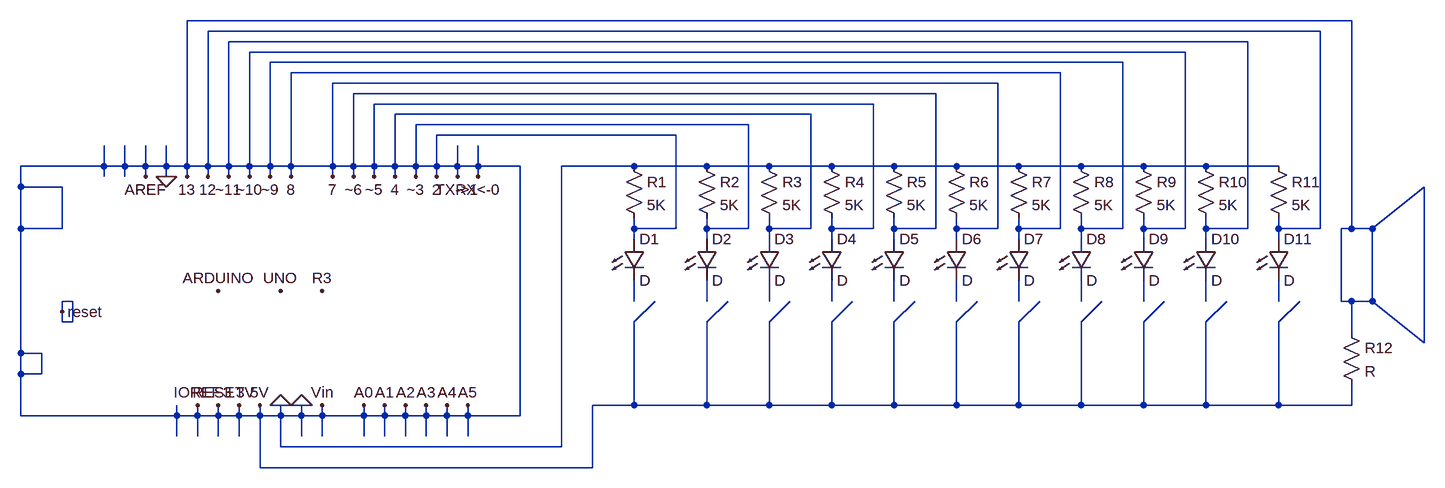
[diagram p0: schematic ARDUINO.asc]
ARDUINO.asc, the LTspice schematic file:
Version 4
SHEET 1 1412 824
WIRE 1184 64 -608 64
WIRE 1136 80 -576 80
WIRE 1024 96 -544 96
WIRE 928 112 -512 112
WIRE 832 128 -480 128
WIRE 736 144 -448 144
WIRE 640 160 -384 160
WIRE 544 176 -352 176
WIRE 448 192 -320 192
WIRE 352 208 -288 208
WIRE 256 224 -256 224
WIRE 144 240 -224 240
WIRE -736 288 -736 256
WIRE -736 288 -864 288
WIRE -704 288 -704 256
WIRE -704 288 -736 288
WIRE -672 288 -672 256
WIRE -672 288 -704 288
WIRE -640 288 -640 256
WIRE -640 288 -672 288
WIRE -608 288 -608 64
WIRE -608 288 -640 288
WIRE -576 288 -576 80
WIRE -576 288 -608 288
WIRE -544 288 -544 96
WIRE -544 288 -576 288
WIRE -512 288 -512 112
WIRE -512 288 -544 288
WIRE -480 288 -480 128
WIRE -480 288 -512 288
WIRE -448 288 -448 144
WIRE -448 288 -480 288
WIRE -384 288 -384 160
WIRE -384 288 -448 288
WIRE -352 288 -352 176
WIRE -352 288 -384 288
WIRE -320 288 -320 192
WIRE -320 288 -352 288
WIRE -288 288 -288 208
WIRE -288 288 -320 288
WIRE -256 288 -256 224
WIRE -256 288 -288 288
WIRE -224 288 -224 240
WIRE -224 288 -256 288
WIRE -192 288 -192 256
WIRE -192 288 -224 288
WIRE -160 288 -160 256
WIRE -160 288 -192 288
WIRE -96 288 -160 288
WIRE 80 288 -32 288
WIRE 192 288 80 288
WIRE 288 288 192 288
WIRE 384 288 288 288
WIRE 480 288 384 288
WIRE 576 288 480 288
WIRE 672 288 576 288
WIRE 768 288 672 288
WIRE 864 288 768 288
WIRE 960 288 864 288
WIRE 1072 288 960 288
WIRE -736 304 -736 288
WIRE -704 304 -704 288
WIRE -672 304 -672 288
WIRE -640 304 -640 288
WIRE -608 304 -608 288
WIRE -576 304 -576 288
WIRE -544 304 -544 288
WIRE -512 304 -512 288
WIRE -480 304 -480 288
WIRE -448 304 -448 288
WIRE -384 304 -384 288
WIRE -352 304 -352 288
WIRE -320 304 -320 288
WIRE -288 304 -288 288
WIRE -256 304 -256 288
WIRE -224 304 -224 288
WIRE -192 304 -192 288
WIRE -160 304 -160 288
WIRE -864 320 -864 288
WIRE -800 320 -864 320
WIRE -864 384 -864 320
WIRE -800 384 -800 320
WIRE -800 384 -864 384
WIRE 80 384 80 368
WIRE 144 384 144 240
WIRE 144 384 80 384
WIRE 192 384 192 368
WIRE 256 384 256 224
WIRE 256 384 192 384
WIRE 288 384 288 368
WIRE 352 384 352 208
WIRE 352 384 288 384
WIRE 384 384 384 368
WIRE 448 384 448 192
WIRE 448 384 384 384
WIRE 480 384 480 368
WIRE 544 384 544 176
WIRE 544 384 480 384
WIRE 576 384 576 368
WIRE 640 384 640 160
WIRE 640 384 576 384
WIRE 672 384 672 368
WIRE 736 384 736 144
WIRE 736 384 672 384
WIRE 768 384 768 368
WIRE 832 384 832 128
WIRE 832 384 768 384
WIRE 864 384 864 368
WIRE 928 384 928 112
WIRE 928 384 864 384
WIRE 960 384 960 368
WIRE 1024 384 1024 96
WIRE 1024 384 960 384
WIRE 1072 384 1072 368
WIRE 1136 384 1136 80
WIRE 1136 384 1072 384
WIRE 1184 384 1184 64
WIRE 1184 384 1168 384
WIRE 1216 384 1296 320
WIRE 1216 384 1184 384
WIRE 80 400 80 384
WIRE 192 400 192 384
WIRE 288 400 288 384
WIRE 384 400 384 384
WIRE 480 400 480 384
WIRE 576 400 576 384
WIRE 672 400 672 384
WIRE 768 400 768 384
WIRE 864 400 864 384
WIRE 960 400 960 384
WIRE 1072 400 1072 384
WIRE -784 496 -800 496
WIRE 80 496 80 464
WIRE 192 496 192 464
WIRE 288 496 288 464
WIRE 384 496 384 464
WIRE 480 496 480 464
WIRE 576 496 576 464
WIRE 672 496 672 464
WIRE 768 496 768 464
WIRE 864 496 864 464
WIRE 960 496 960 464
WIRE 1072 496 1072 464
WIRE 1168 496 1168 384
WIRE 1184 496 1168 496
WIRE 1216 496 1216 384
WIRE 1216 496 1184 496
WIRE -800 512 -800 496
WIRE -800 528 -800 512
WIRE -784 528 -784 496
WIRE -784 528 -800 528
WIRE 80 528 112 496
WIRE 192 528 224 496
WIRE 288 528 320 496
WIRE 384 528 416 496
WIRE 480 528 512 496
WIRE 576 528 608 496
WIRE 672 528 704 496
WIRE 768 528 800 496
WIRE 864 528 896 496
WIRE 960 528 992 496
WIRE 1072 528 1104 496
WIRE 1184 544 1184 496
WIRE 1296 560 1296 320
WIRE 1296 560 1216 496
WIRE -864 576 -864 384
WIRE -832 576 -864 576
WIRE -864 608 -864 576
WIRE -832 608 -832 576
WIRE -832 608 -864 608
WIRE 80 656 80 528
WIRE 80 656 16 656
WIRE 192 656 192 528
WIRE 192 656 80 656
WIRE 288 656 288 528
WIRE 288 656 192 656
WIRE 384 656 384 528
WIRE 384 656 288 656
WIRE 480 656 480 528
WIRE 480 656 384 656
WIRE 576 656 576 528
WIRE 576 656 480 656
WIRE 672 656 672 528
WIRE 672 656 576 656
WIRE 768 656 768 528
WIRE 768 656 672 656
WIRE 864 656 864 528
WIRE 864 656 768 656
WIRE 960 656 960 528
WIRE 960 656 864 656
WIRE 1072 656 1072 528
WIRE 1072 656 960 656
WIRE 1184 656 1184 624
WIRE 1184 656 1072 656
WIRE -864 672 -864 608
WIRE -624 672 -624 656
WIRE -624 672 -864 672
WIRE -592 672 -592 656
WIRE -592 672 -624 672
WIRE -560 672 -560 656
WIRE -560 672 -592 672
WIRE -528 672 -528 656
WIRE -528 672 -560 672
WIRE -496 672 -496 656
WIRE -496 672 -528 672
WIRE -464 672 -464 656
WIRE -464 672 -496 672
WIRE -432 672 -432 656
WIRE -432 672 -464 672
WIRE -400 672 -400 656
WIRE -400 672 -432 672
WIRE -336 672 -336 656
WIRE -336 672 -400 672
WIRE -304 672 -304 656
WIRE -304 672 -336 672
WIRE -272 672 -272 656
WIRE -272 672 -304 672
WIRE -240 672 -240 656
WIRE -240 672 -272 672
WIRE -208 672 -208 656
WIRE -208 672 -240 672
WIRE -176 672 -176 656
WIRE -176 672 -208 672
WIRE -96 672 -96 288
WIRE -96 672 -176 672
WIRE -624 704 -624 672
WIRE -592 704 -592 672
WIRE -560 704 -560 672
WIRE -528 704 -528 672
WIRE -432 704 -432 672
WIRE -400 704 -400 672
WIRE -336 704 -336 672
WIRE -304 704 -304 672
WIRE -272 704 -272 672
WIRE -240 704 -240 672
WIRE -208 704 -208 672
WIRE -176 704 -176 672
WIRE -464 720 -464 672
WIRE -32 720 -32 288
WIRE -32 720 -464 720
WIRE -496 752 -496 672
WIRE 16 752 16 656
WIRE 16 752 -496 752
FLAG -800 512 reset
FLAG -592 656 IOREF
FLAG -560 656 RESET
FLAG -528 656 3.3V
FLAG -496 656 5V
FLAG -464 656 0
FLAG -432 656 0
FLAG -400 656 Vin
FLAG -336 656 A0
FLAG -304 656 A1
FLAG -272 656 A2
FLAG -240 656 A3
FLAG -208 656 A4
FLAG -176 656 A5
FLAG -160 304 RX<-0
FLAG -192 304 TX->1
FLAG -224 304 2
FLAG -256 304 ~3
FLAG -288 304 4
FLAG -320 304 ~5
FLAG -352 304 ~6
FLAG -384 304 7
FLAG -448 304 8
FLAG -480 304 ~9
FLAG -512 304 ~10
FLAG -544 304 ~11
FLAG -576 304 12
FLAG -608 304 13
FLAG -640 304 0
FLAG -672 304 AREF
FLAG -560 480 ARDUINO
FLAG -464 480 UNO
FLAG -400 480 R3
SYMBOL res 64 272 R0
SYMATTR InstName R1
SYMATTR Value 5K
SYMBOL LED 64 400 R0
SYMATTR InstName D1
SYMBOL res 176 272 R0
SYMATTR InstName R2
SYMATTR Value 5K
SYMBOL LED 176 400 R0
SYMATTR InstName D2
SYMBOL res 272 272 R0
SYMATTR InstName R3
SYMATTR Value 5K
SYMBOL LED 272 400 R0
SYMATTR InstName D3
SYMBOL res 368 272 R0
SYMATTR InstName R4
SYMATTR Value 5K
SYMBOL LED 368 400 R0
SYMATTR InstName D4
SYMBOL res 464 272 R0
SYMATTR InstName R5
SYMATTR Value 5K
SYMBOL LED 464 400 R0
SYMATTR InstName D5
SYMBOL res 560 272 R0
SYMATTR InstName R6
SYMATTR Value 5K
SYMBOL LED 560 400 R0
SYMATTR InstName D6
SYMBOL res 656 272 R0
SYMATTR InstName R7
SYMATTR Value 5K
SYMBOL LED 656 400 R0
SYMATTR InstName D7
SYMBOL res 752 272 R0
SYMATTR InstName R8
SYMATTR Value 5K
SYMBOL LED 752 400 R0
SYMATTR InstName D8
SYMBOL res 848 272 R0
SYMATTR InstName R9
SYMATTR Value 5K
SYMBOL LED 848 400 R0
SYMATTR InstName D9
SYMBOL res 944 272 R0
SYMATTR InstName R10
SYMATTR Value 5K
SYMBOL LED 944 400 R0
SYMATTR InstName D10
SYMBOL res 1056 272 R0
SYMATTR InstName R11
SYMATTR Value 5K
SYMBOL LED 1056 400 R0
SYMATTR InstName D11
SYMBOL res 1168 528 R0
SYMATTR InstName R12

The netlist it stands for:
* ARDUINO.asc
R1 0 0 5K
D1 0 N001 D
R2 0 0 5K
D2 0 N002 D
R3 0 0 5K
D3 0 N003 D
R4 0 0 5K
D4 0 N004 D
R5 0 0 5K
D5 0 N005 D
R6 0 0 5K
D6 0 N006 D
R7 0 0 5K
D7 0 N007 D
R8 0 0 5K
D8 0 N008 D
R9 0 0 5K
D9 0 N009 D
R10 0 0 5K
D10 0 N010 D
R11 0 0 5K
D11 0 N011 D
R12 0 0 R
.model D D
.lib standard.dio
.backanno
.end